# EAGLE design LasCon (EAGLE 6.5.0)
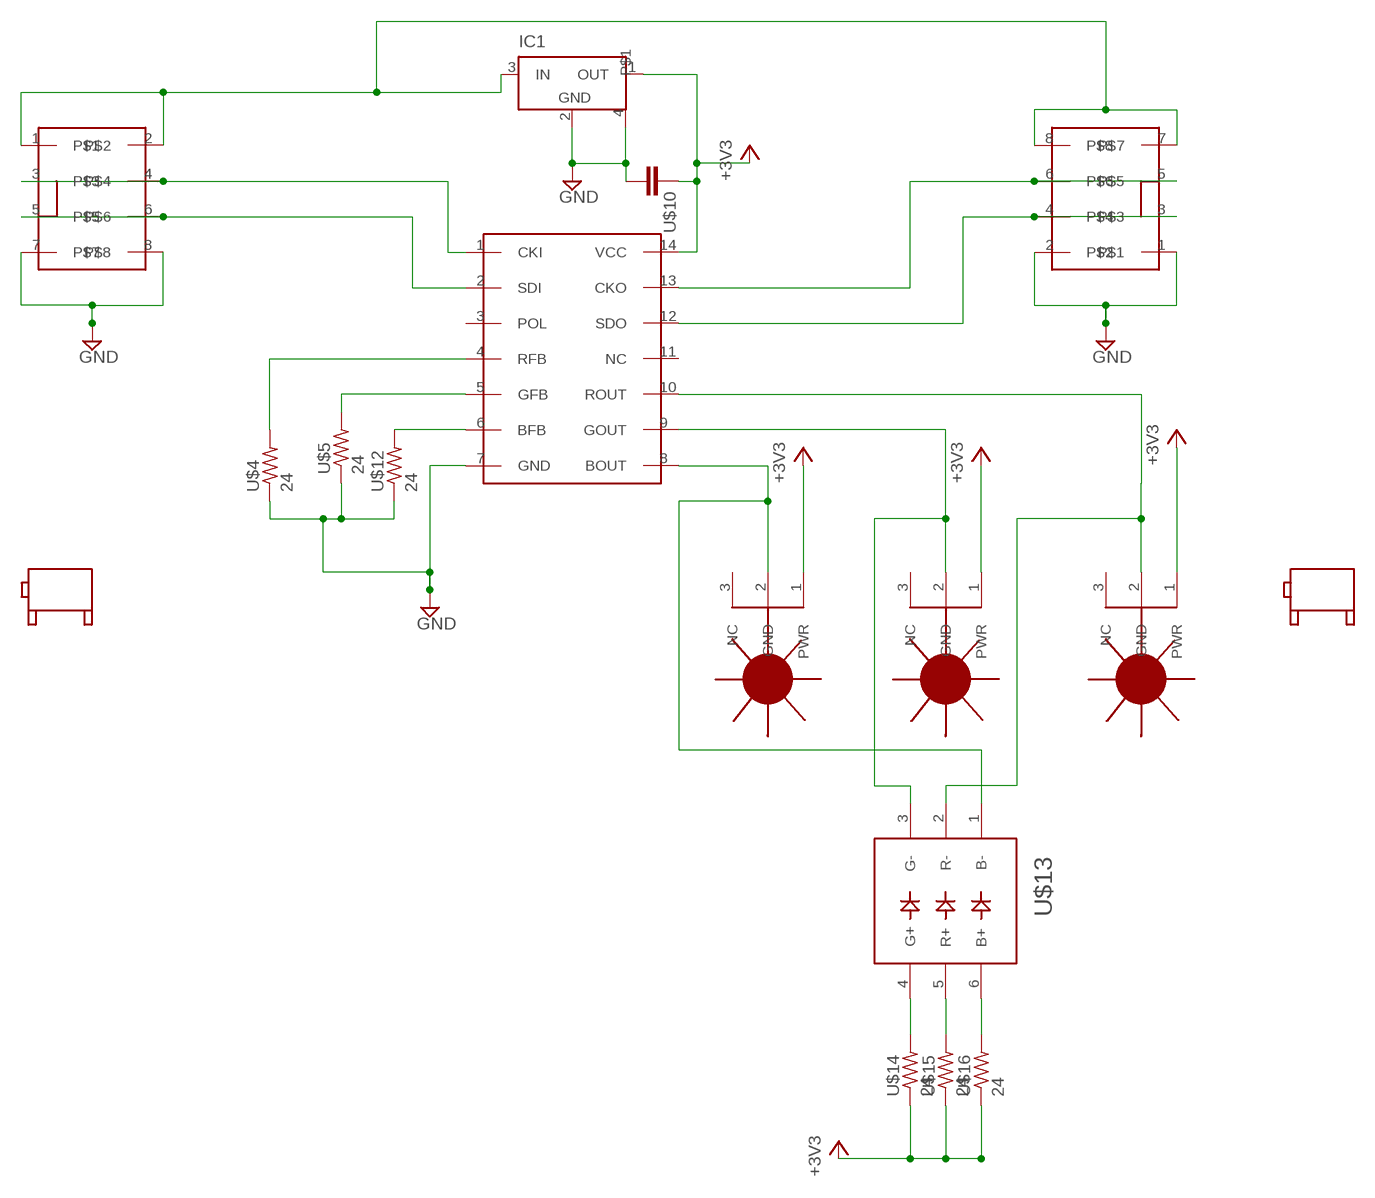
[diagram p0: schematic, sheet 1]

## Parts
IC1  MCP1804T-3302I  [SOT223]
U$1  2X4IDC  [2X04]
U$2  2X4IDC  [2X04]
U$3  WS2801  [SO14]
U$4  24  RF-R0805  [RF-C0805]
U$5  24  RF-R0805  [RF-C0805]
U$6  LASER  [LASER]
U$7  LASER  [LASER]
U$8  90DEGMNT  [90DEGMNT]
U$9  90DEGMNT  [90DEGMNT]
U$10  RF-C0805  [C0805]
U$11  LASER  [LASER]
U$12  24  RF-R0805  [RF-C0805]
U$13  LED5060A  [PLCC-6]
U$14  24  RF-R0805  [RF-C0805]
U$15  24  RF-R0805  [RF-C0805]
U$16  24  RF-R0805  [RF-C0805]

## Nets
+3V3: IC1.1(OUT) U$3.14(VCC) U$6.1(PWR) U$7.1(PWR) U$10.1 U$11.1(PWR) U$14.1 U$15.1 U$16.1
GND: IC1.2(GND) IC1.4 U$1.7 U$1.8 U$2.1 U$2.2 U$3.7(GND) U$4.1 U$5.1 U$10.2 U$12.1
N$1: IC1.3(IN) U$1.1 U$1.2 U$2.7 U$2.8
N$2: U$3.9(GOUT) U$6.2(GND) U$13.3(G-)
N$3: U$3.10(ROUT) U$7.2(GND) U$13.2(R-)
N$4: U$3.8(BOUT) U$11.2(GND) U$13.1(B-)
N$5: U$1.3 U$1.4 U$3.1(CKI)
N$6: U$1.5 U$1.6 U$3.2(SDI)
N$7: U$2.5 U$2.6 U$3.13(CKO)
N$8: U$2.3 U$2.4 U$3.12(SDO)
N$9: U$3.4(RFB) U$4.2
N$10: U$3.5(GFB) U$5.2
N$11: U$3.6(BFB) U$12.2
N$12: U$13.4(G+) U$14.2
N$13: U$13.5(R+) U$15.2
N$14: U$13.6(B+) U$16.2
Unconnected: U$3.3(POL) U$3.11(NC) U$6.3(NC) U$7.3(NC) U$11.3(NC)

## Library data of the parts
IC1 = microchip:MCP1804T-3302I: VOLTAGE REGULATOR; MPN: MCP1804T-3302I/DB
U$1 U$2 = GW-devices:2X4IDC; MPN: 75869-132LF
U$3 = GW-devices:WS2801
U$4 U$5 U$12 U$14-U$16 = GW-devices:RF-R: RF resistor pads for FSL reference design
U$6 U$7 U$11 = GW-devices:LASER
U$8 U$9 = GW-devices:90DEGMNT; MFGN: Keystone Electronics; MFGP: 7774
U$10 = GW-devices:RF-C: RF capacitor pads for FSL reference design
U$13 = GW-devices:LED5060: PLCC-6 5060 6000mcd RGB LED; PRICE: 0.25

## Board
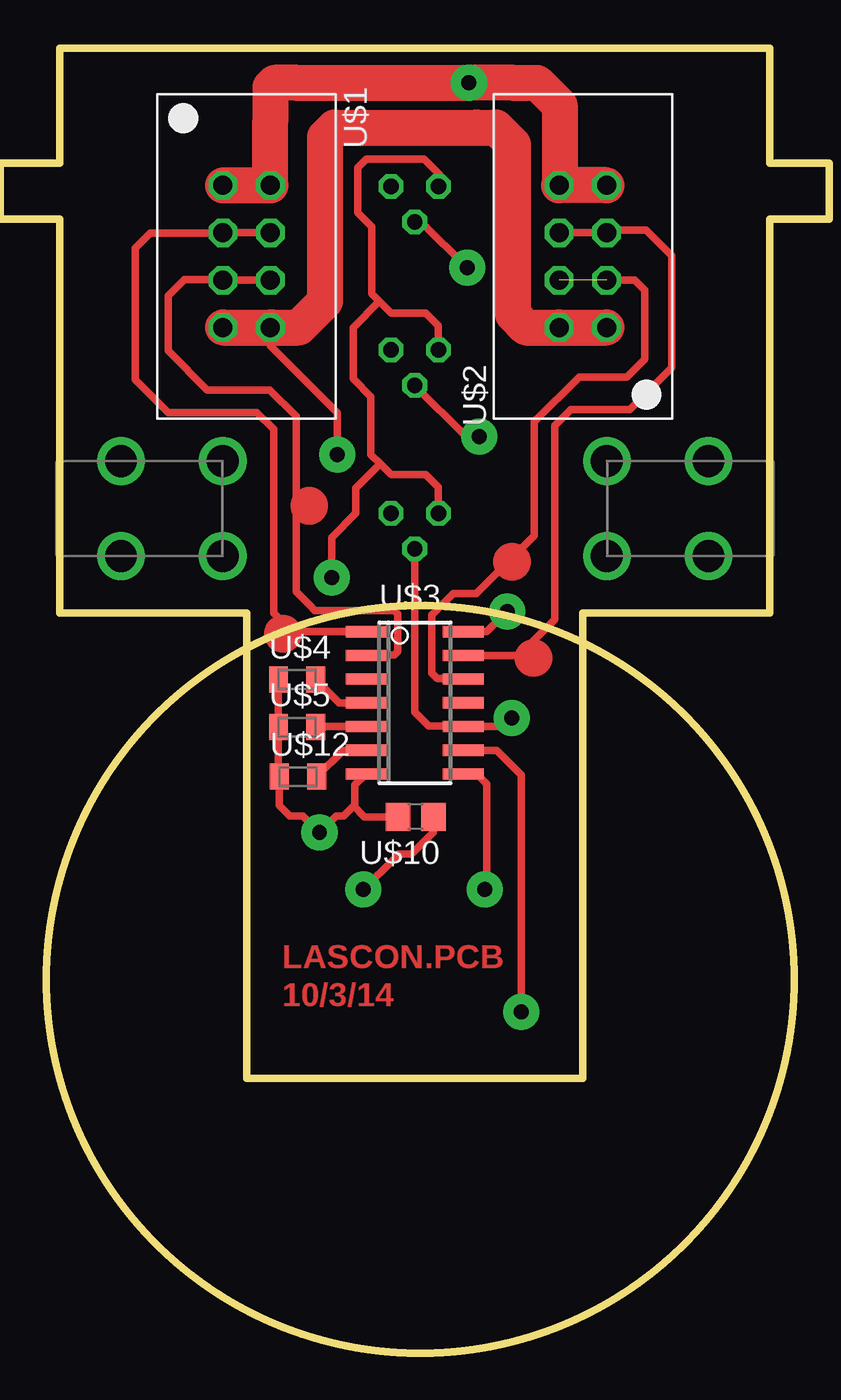
[diagram p1: board, top side]
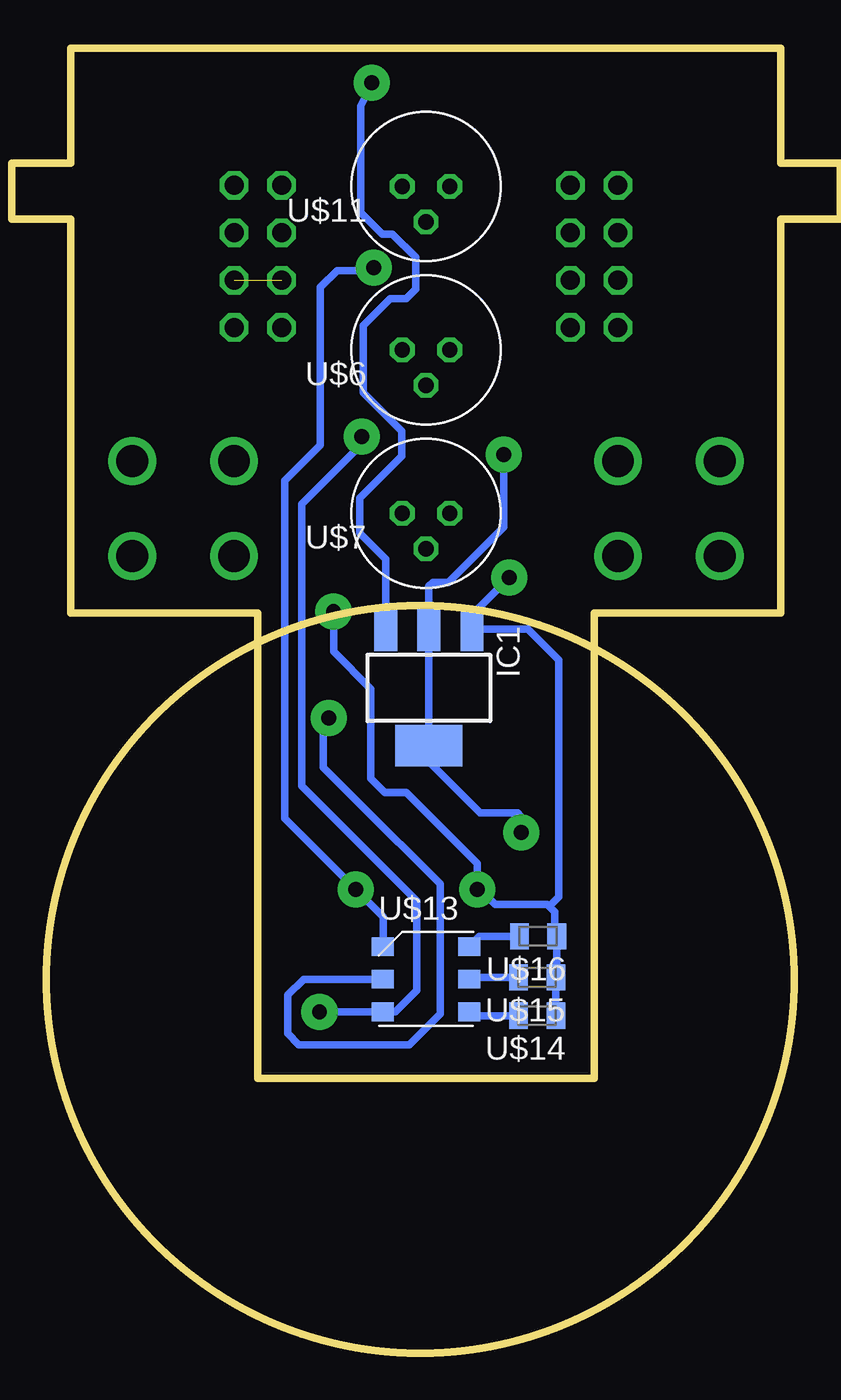
[diagram p2: board, bottom side, seen from below]

Size 40 x 40 mm. Coordinates in mm from the lower left corner, seen from the top.
Outline: circle at 20,20 radius 20
Copper layers (1*16): Top 0.0356mm / dielectric 1.5011mm / Bottom 0.0356mm
Design rules "SilverCircuits *": minimum track width 7mil, minimum drill 14mil, track to track 7mil, track to pad 7mil, pad to pad 7mil, via to via 7mil, smd to smd 0mil, copper to edge 20mil, drill to drill 8mil, minimum pad ring 10mil, minimum via ring 8mil, stop-mask expansion 4mil, vias tented up to drill 0mil, thermal gap 10mil
Milling: 18 lines

### Footprints (pad centres in the part's own frame; a part is rotated, then mirrored left to right if it is on the bottom)
SOT223 = smd 1.219 x 2.235: 1 -2.311,-3.099; 2 0,-3.099; 3 2.311,-3.099 | smd 3.6 x 2.2: 4 0,3.099
2X04 = drill 1.016 octagon: 1 -3.81,-1.27; 2 -3.81,1.27; 3 -1.27,-1.27; 4 -1.27,1.27; 5 1.27,-1.27; 6 1.27,1.27; 7 3.81,-1.27; 8 3.81,1.27
SO14 = smd 0.6 x 2.2: 1 -3.81,-2.6; 2 -2.54,-2.6; 3 -1.27,-2.6; 4 0,-2.6; 5 1.27,-2.6; 6 2.54,-2.6; 7 3.81,-2.6; 8 3.81,2.6; 9 2.54,2.6; 10 1.27,2.6; 11 0,2.6; 12 -1.27,2.6; 13 -2.54,2.6; 14 -3.81,2.6
RF-C0805 = smd 1 x 1.4: 1 -1,0; 2 1,0
LASER = drill 0.813 octagon: 1 1.27,0; 2 0,1.905; 3 -1.27,0
90DEGMNT = drill 1.7: P$1 -2.72,2.54; P$2 2.72,2.54; P$3 -2.72,-2.54; P$4 2.72,-2.54
C0805 = smd 1.3 x 1.5: 1 -0.95,0; 2 0.95,0
PLCC-6 = smd 1.18 x 1: 1 -2.31,1.75; 2 -2.31,0; 3 -2.31,-1.75; 4 2.31,-1.75; 5 2.31,0; 6 2.31,1.75

### Placement (x,y rotation side)
IC1  19.55,35.6 180 bottom
U$1  10.7,58.7 270 top  (outside the outline)
U$2  28.7,58.7 90 top  (outside the outline)
U$3  19.7,34.8 270 top
U$4  13.4,36.05 0 top
U$5  13.4,33.5 0 top
U$6  19.7,53.7 180 bottom  (outside the outline)
U$7  19.7,44.95 180 bottom  (outside the outline)
U$8  6.7,45.2 0 top
U$9  32.7,45.2 180 top
U$10  19.75,28.7 180 top
U$11  19.7,62.45 180 bottom  (outside the outline)
U$12  13.45,30.85 0 top
U$13  19.7,20 0 bottom
U$14  13.75,18.05 180 bottom
U$15  13.75,20.1 180 bottom
U$16  13.7,22.3 180 bottom

### Tracks (layer width: path | path; a pad name or v marks a point on that pad's centre or on a via)
+3V3  (via drill 0.8 pad 1.93)
  Top 0.406: 17.85,47.6 17.95,47.5 18.43,47.02 20.28,47.02 20.95,46.35 20.95,44.97 U$7.1 | 17.85,47.6 17.35,48.1 17.35,51.2 16.4,52.15 16.4,54.9 17.8,56.3 | 17.8,56.3 18.43,55.67 20.28,55.67 20.95,55 20.95,53.72 U$6.1 | 17.8,56.3 17.4,56.7 17.4,60.27 17.4,60.3 16.65,61.05 16.65,63.45 17.1,63.9 20.2,63.9 21,63.1 21,62.48 U$11.1 | v16.95,24.8 18.65,26.5 18.85,26.7 19.55,26.7 20.7,27.85 U$10.1 | v15.25,41.5 15.25,43.65 16.55,44.95 16.55,46.3 17.85,47.6 | U$3.14 23.56,38.61 v24.65,39.7
  Bottom 0.406: U$14.1 U$15.1 12.7,20.15 U$16.1 12.8,22.4 12.8,23.6 13.1,23.9 | 13.1,23.9 13.2,24 16,24 16.8,24.8 v16.95,24.8 16.95,26.2 20.75,30 21.8,30 21.9,30 21.95,30.05 22.65,30.75 22.65,35.55 24.65,37.55 v24.65,39.7 | 13.1,23.9 12.6,24.4 12.6,37.1 14.25,38.75 17.19,38.75 | 17.19,38.75 IC1.1 | 17.19,38.75 17.19,39.56 v15.25,41.5
GND  (via drill 0.8 pad 1.93)
  Top 0.406: U$4.1 U$5.1 12.4,30.9 U$12.1 12.45,29.3 13,28.75 13.7,28.75 v14.6,27.85 15.5,28.75 15.9,28.75 16.43,29.28 | 16.43,29.28 16.5,29.35 16.5,30.39 U$3.7 | U$10.2 17,28.7 16.43,29.28 | U$1.8 11.97,53.93 15.55,50.35 v15.55,48.1
  Top 1.93: U$1.7 U$1.8 | 12.06,54.9 13.5,54.9 14.9,56.3 14.9,63.25 14.9,64.9 14.9,65.1 15.4,65.6 16.75,65.6 23,65.6 24.05,65.6 24.95,64.7 24.95,64 24.95,62.55 24.95,55.6 25.65,54.9 U$2.2 U$2.1
  Bottom 0.406: IC1.4 IC1.2 19.55,41.05 19.35,41.25 18.5,41.25 15.55,44.2 v15.55,48.1 | 19.95,32.1 IC1.4 | IC1.4 19.55,31.65 16.8,28.9 14.8,28.9 14.6,28.7 v14.6,27.85
N$1  (via drill 0.8 pad 1.93)
  Top 0.406: U$2.8
  Top 1.93: U$1.1 U$1.2 11.97,66.02 11.97,67.77 12.2,68 13.4,68 v22.6,68 25,68 25.55,68 26.25,68 27.45,66.8 27.45,62.53 U$2.8 U$2.7
  Bottom 0.406: IC1.3 21.86,42.51 23.25,43.9 23.25,45.75 21,48 21,49.35 23.05,51.4 23.05,55 21.6,56.45 20.75,56.45 20.25,56.95 20.25,58.65 21.5,59.9 22.05,59.9 23.2,61.05 23.2,66.1 23.2,66.75 v22.6,68
N$2  (via drill 0.8 pad 1.93)
  Top 0.406: v25.4,18.25 25.4,30.95 24.1,32.25 U$3.9 | v23.15,49.05 22.45,49.05 U$6.2
  Bottom 0.406: v25.4,18.25 U$13.3 21.35,18.25 20.2,19.4 20.2,24.2 26.35,30.35 26.35,30.5 26.35,34.95 26.35,45.45 25.65,46.15 23.15,48.65 v23.15,49.05
N$3  (via drill 0.8 pad 1.93)
  Top 0.406: v24.9,33.98 24.45,33.53 U$3.10 22.28,33.55 20.45,33.55 19.7,34.3 U$7.2
  Bottom 0.406: 23.5,20 U$13.2 26.25,20 27.1,19.15 27.1,17.1 26.5,16.5 20.6,16.5 18.95,18.15 18.95,19.1 18.95,25.1 19.35,25.5 22.9,29.05 25.2,31.35 25.2,33.68 v24.9,33.98
N$4  (via drill 0.8 pad 1.93)
  Top 0.406: U$3.8 23.01,30.99 23.55,30.45 23.55,27.15 23.55,24.9 v23.45,24.8 | U$11.2 20.05,60.55 v22.5,58.1
  Bottom 0.406: U$13.1 22,23.35 v23.45,24.8 27.25,28.6 27.25,29 27.25,35.35 27.25,35.55 27.25,46.7 25.35,48.6 25.35,57.05 24.45,57.95 22.65,57.95 v22.5,58.1
N$5
  Top 0.406: U$3.1 15.34,38.61 13.14,38.61 12.15,39.6 12.15,49.45 11.25,50.35 6.5,50.35 4.75,52.1 4.75,59.15 5.55,59.95 9.41,59.95 U$1.3 U$1.4
N$6
  Top 0.406: U$1.6 U$1.5 9.41,57.45 7.35,57.45 6.5,56.6 6.5,53.65 8.6,51.55 11.95,51.55 13.35,50.15 13.35,40.8 13.35,40.75 14.05,40.05 14.35,39.75 16.4,39.75 18.6,39.75 18.8,39.55 18.8,37.55 18.6,37.35 U$3.2
N$7
  Top 0.406: U$3.13 25.29,37.34 26.05,38.1 27.2,39.25 27.2,49.65 28.05,50.5 28.55,50.5 31.2,50.5 33.45,52.75 33.45,58.75 32.1,60.1 30.1,60.1 U$2.5 U$2.6
N$8  (1 unrouted)
  Top 0.406: U$2.3 31.47,57.43 32,56.9 32,53.2 31.05,52.25 28.5,52.25 26.1,49.85 26.1,43.75 23,40.65 21.75,40.65 20.95,39.85 20.6,39.5 20.6,36.4 20.9,36.1 22.27,36.1 U$3.12
N$9
  Top 0.406: U$3.4 15.65,34.8 U$4.2
N$10
  Top 0.406: U$3.5 14.43,33.53 U$5.2
N$11
  Top 0.406: U$3.6 15.86,32.26 U$12.2
N$12
  Bottom 0.406: U$14.2 17.19,18.05 U$13.4
N$13
  Bottom 0.406: U$15.2 17.29,20.1 U$13.5
N$14
  Bottom 0.406: U$16.2 16.84,22.3 U$13.6
(copper drawn outside any net)
  shapes: Top circle x4

### Text on the board
Top: LASCON.PCB / 10/3/14